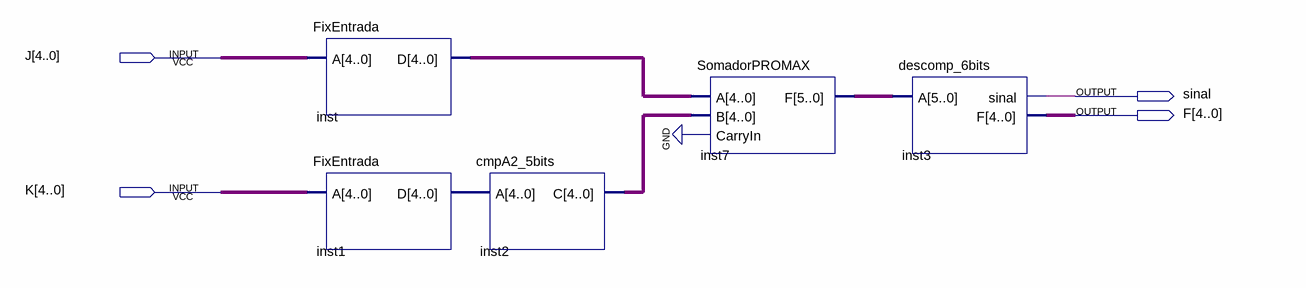
[diagram p0: schematic sheet]
// Quartus schematic SubtratorDefinitivo.bdf as structural Verilog: 5 symbols, 4 pins
module SubtratorDefinitivo (
  input  [4:0] J,
  input  [4:0] K,
  output sinal,
  output [4:0] F
);

  wire [4:0] inst1_d, inst2_c, inst_d;
  wire [5:0] inst7_f;

  FixEntrada inst (.A(J), .D(inst_d));
  FixEntrada inst1 (.A(K), .D(inst1_d));
  cmpA2_5bits inst2 (.A(inst1_d), .C(inst2_c));
  SomadorPROMAX inst7 (.A(inst_d), .B(inst2_c), .CarryIn(1'b0), .F(inst7_f));
  descomp_6bits inst3 (.A(inst7_f), .sinal(sinal), .F(F));
endmodule
